# Altium project ZHL_RF_AMP.PrjPcb
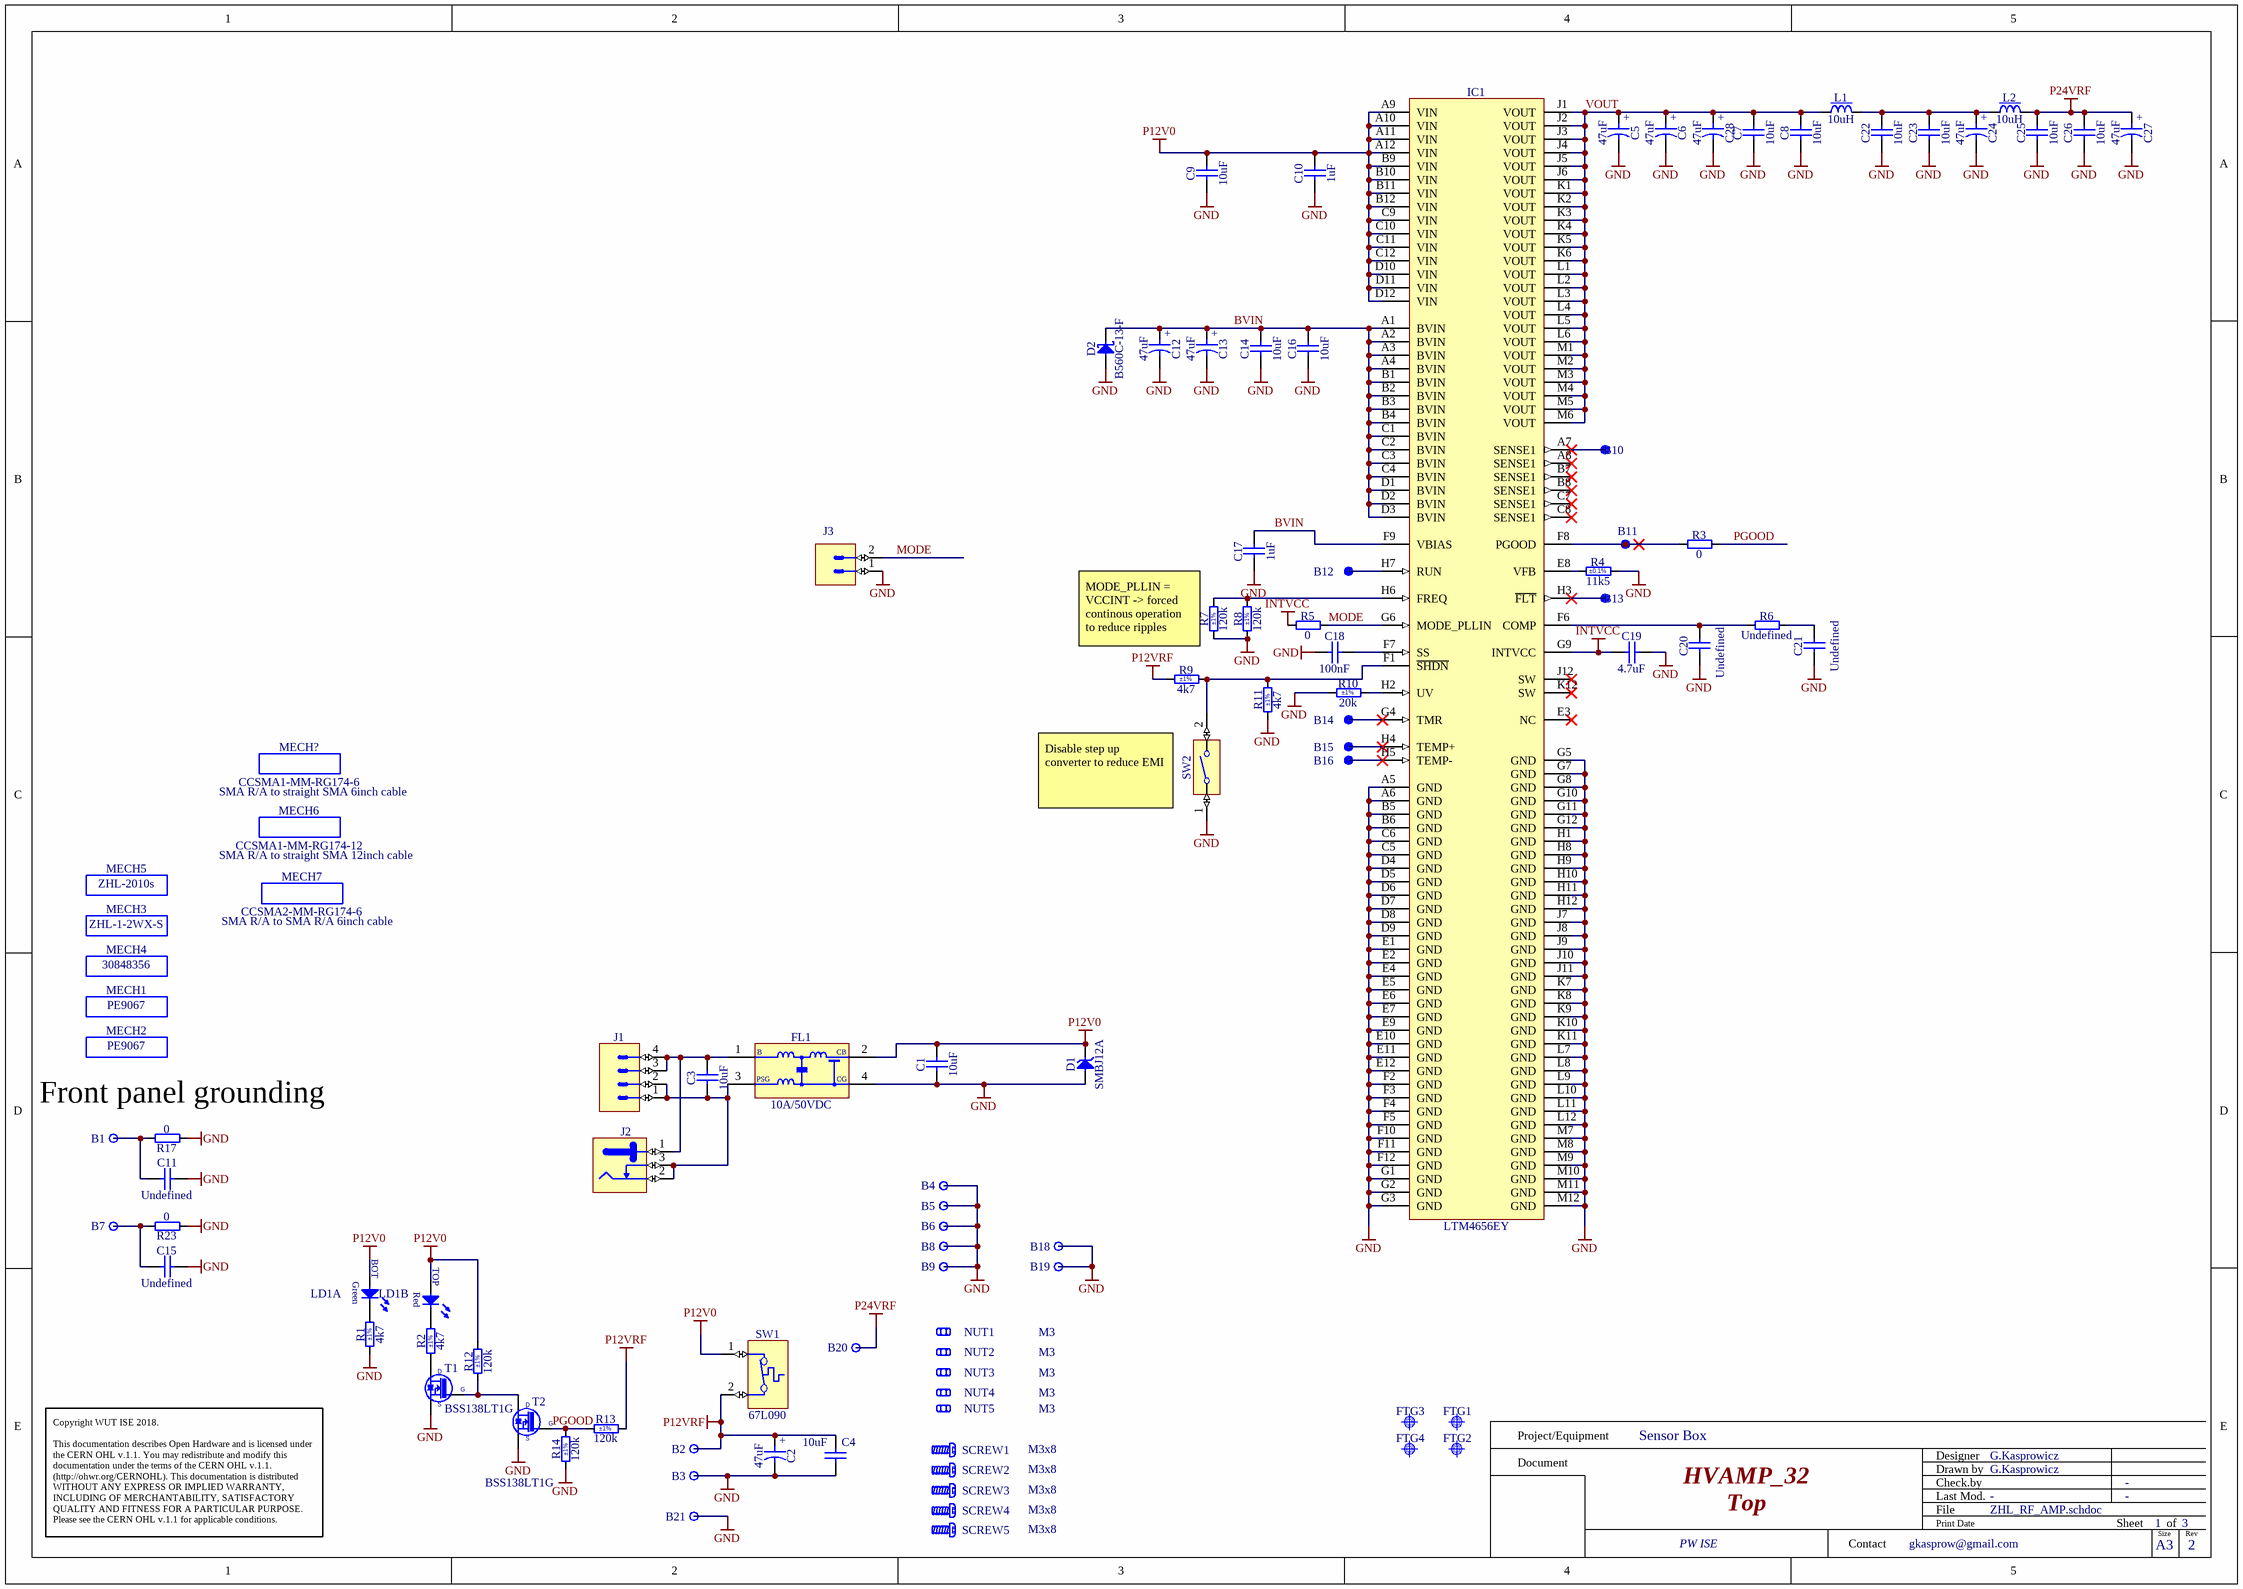
[diagram p0: ZHL_RF_AMP.schdoc]
1 sheet, 100 parts. Net scope: global (net labels, ports and power ports of the same name join across sheets).
Board files: ZHL_RF_AMP.pcbdoc, Panel_ZHL-1-2WX-S_RF_AMP.PcbDoc, Panel_ZHL-2010s_RF_AMP.PcbDoc

## Sheet ZHL_RF_AMP.schdoc: HVAMP_32
size 420 x 297 mm; EDA_Number: ARTIQ; Projet: Fastino; Author: G.Kasprowicz; CompanyName: WUT ISE; DrawnBy: G.Kasprowicz; Organization: WUT ISE; Address1: PW ISE; Address2: Nowowiejska 15/19 00-665 Warsaw; Address3: gkasprow@gmail.com; DocumentNumber: 1; Revision: 2; SheetNumber: 1; SheetTotal: 3; ModifiedBy: -; CheckedDate: -; Title2: Top; DivGrp: WUT ISE; Designer: G.Kasprowicz; ModifiedDate: -; ProjectName: Sensor Box

### Parts
B1  Plated Hole  [MTG270_500]  (value not drawn)
B2  Plated Hole  [c130h80]  (value not drawn)  (no BOM)
B3  Plated Hole  [c130h80]  (value not drawn)  (no BOM)
B4  Plated Hole  [MTG320_700]  (value not drawn)  (no BOM)
B5  Plated Hole  [MTG320_700]  (value not drawn)  (no BOM)
B6  Plated Hole  [MTG320_700]  (value not drawn)  (no BOM)
B7  Plated Hole  [MTG270_500]  (value not drawn)
B8  Plated Hole  [MTG320_700]  (value not drawn)  (no BOM)
B9  Plated Hole  [MTG320_700]  (value not drawn)  (no BOM)
B10  SMD Pad  [C100]  (value not drawn)
B11  SMD Pad  [C100]  (value not drawn)
B12  SMD Pad  [C100]  (value not drawn)
B13  SMD Pad  [C100]  (value not drawn)
B14  SMD Pad  [C100]  (value not drawn)
B15  SMD Pad  [C100]  (value not drawn)
B16  SMD Pad  [C100]  (value not drawn)
B18  Plated Hole  [MTG320_700]  (value not drawn)  (no BOM)
B19  Plated Hole  [MTG320_700]  (value not drawn)  (no BOM)
B20  Plated Hole  [c130h80]  (value not drawn)  (no BOM)
B21  Plated Hole  [c130h80]  (value not drawn)  (no BOM)
C1  10uF  [CAPC3216X190N]
C2  47uF  [CAPMP7343X430N]
C3  10uF  [CAPC3216X190N]
C4  10uF  [CAPC3216X190N]
C5  47uF  [CAPMP7343X430N]
C6  47uF  [CAPMP7343X430N]
C7  10uF  [CAPC3216X190N]
C8  10uF  [CAPC3216X190N]
C9  10uF  [CAPC3216X190N]
C10  1uF  [CAPC1608X87N]
C11  Undefined  [CAPC2012X135N]
C12  47uF  [CAPMP7343X430N]
C13  47uF  [CAPMP7343X430N]
C14  10uF  [CAPC3216X190N]
C15  Undefined  [CAPC2012X135N]
C16  10uF  [CAPC3216X190N]
C17  1uF  [CAPC1608X87N]
C18  100nF  [CAPC1005X55N]
C19  4.7uF  [CAPC1608X90N]
C20  Undefined  [CAPC1608X90N]
C21  Undefined  [CAPC1608X90N]
C22  10uF  [CAPC3216X190N]
C23  10uF  [CAPC3216X190N]
C24  47uF  [CAPMP7343X430N]
C25  10uF  [CAPC3216X190N]
C26  10uF  [CAPC3216X190N]
C27  47uF  [CAPMP7343X430N]
C28  47uF  [CAPMP7343X430N]
D1  SMBJ12A  [DIOM5336X265N]
D2  B560C-13-F  [DIOM7959X250N]
FL1  10A/50VDC  [FIL_MURATA_BNX02]
FTG1  Use only in PCB  [FIDUCIAL_TOP_C100-200]  (value not drawn)
FTG2  Use only in PCB  [FIDUCIAL_TOP_S100-200]  (value not drawn)
FTG3  Use only in PCB  [FIDUCIAL_TOP_C100-200]  (value not drawn)
FTG4  Use only in PCB  [FIDUCIAL_TOP_S100-200]  (value not drawn)
IC1  LTM4656EY  [BGA144C127P12X12_1600X1600X742]
J1  Mini-Fit Jr.™  [MOLEX_39-30-0040]  (value not drawn)
J2  Jack  [SWITCHCRAFT_712RA]  (value not drawn)
J3  Header 2  [SAMTEC_HTSW-101-23-L-D]  (value not drawn)
L1  10uH  [INDM6965X300N]
L2  10uH  [INDM6965X300N]
LD1  Red/Green  [LED_DIALIGHT_571-0112F]  (value not drawn)  (parts A,B of 2)
MECH1  PE9067  [GENERIC_MECH]
MECH2  PE9067  [GENERIC_MECH]
MECH3  ZHL-1-2WX-S  [GENERIC_MECH]
MECH4  30848356  [GENERIC_MECH]
MECH5  ZHL-2010s  [GENERIC_MECH]
MECH6  CCSMA1-MM-RG174-12  Part Description: SMA R/A to straight SMA 12inch cable  [GENERIC_MECH]
MECH7  CCSMA2-MM-RG174-6  Part Description: SMA R/A to SMA R/A 6inch cable  [GENERIC_MECH]
MECH?  CCSMA1-MM-RG174-6  Part Description: SMA R/A to straight SMA 6inch cable  [GENERIC_MECH]
NUT1  M3  [BOSSARD_BN628-1241443_v]
NUT2  M3  [BOSSARD_BN628-1241443_v]
NUT3  M3  [BOSSARD_BN628-1241443_v]
NUT4  M3  [BOSSARD_BN628-1241443_v]
NUT5  M3  [BOSSARD_BN628-1241443_v]
R1  4k7  Tolerance: ±1%  [RESC1608X55N]
R2  4k7  Tolerance: ±1%  [RESC1608X55N]
R3  0  [RESC1608X55N]
R4  11k5  Tolerance: ±0.1%  [RESC1608X55N]
R5  0  [RESC1608X55N]
R6  Undefined  [RESC1608X55N]
R7  120k  Tolerance: ±1%  [RESC1005X40N]
R8  120k  Tolerance: ±1%  [RESC1005X40N]
R9  4k7  Tolerance: ±1%  [RESC1608X55N]
R10  20k  Tolerance: ±1%  [RESC1608X55N]
R11  4k7  Tolerance: ±1%  [RESC1608X55N]
R12  120k  Tolerance: ±1%  [RESC1005X40N]
R13  120k  Tolerance: ±1%  [RESC1005X40N]
R14  120k  Tolerance: ±1%  [RESC1005X40N]
R17  0  [RESC1608X55N]
R23  0  [RESC1608X55N]
SCREW1  M3x8  [BOSSARD_BN5687-3061606_v]
SCREW2  M3x8  [BOSSARD_BN5687-3061606_v]
SCREW3  M3x8  [BOSSARD_BN5687-3061606_v]
SCREW4  M3x8  [BOSSARD_BN5687-3061606_v]
SCREW5  M3x8  [BOSSARD_BN5687-3061606_v]
SW1  67L090  [AIRPAX_6700_h_a]
SW2  Switch  [SW_OMRON_A6SN-1101]  (value not drawn)
T1  BSS138LT1G  [SOT95P240X110-3N]
T2  BSS138LT1G  [SOT95P240X110-3N]

### Nets
GND: B3.1 B4.1 B5.1 B6.1 B8.1 B9.1 B18.1 B19.1 B21.1 C1.1 C2.2 C4.1 C5.2 C6.2 C7.1 C8.1 C9.1 C10.1 C11.2 C12.2 C13.2 C14.1 C15.2 C16.1 C17.1 C18.1 C19.2 C20.1 C21.1 C22.1 C23.1 C24.2 C25.1 C26.1 C27.2 C28.2 D1.2(A) D2.2(A) FL1.4(CG) IC1.A5(GND) IC1.A6(GND) IC1.B5(GND) IC1.B6(GND) IC1.C5(GND) IC1.C6(GND) IC1.D4(GND) IC1.D5(GND) IC1.D6(GND) IC1.D7(GND) IC1.D8(GND) IC1.D9(GND) IC1.E1(GND) IC1.E2(GND) IC1.E4(GND) IC1.E5(GND) IC1.E6(GND) IC1.E7(GND) IC1.E9(GND) IC1.E10(GND) IC1.E11(GND) IC1.E12(GND) IC1.F2(GND) IC1.F3(GND) IC1.F4(GND) IC1.F5(GND) IC1.F10(GND) IC1.F11(GND) IC1.F12(GND) IC1.G1(GND) IC1.G2(GND) IC1.G3(GND) IC1.G5(GND) IC1.G7(GND) IC1.G8(GND) IC1.G10(GND) IC1.G11(GND) IC1.G12(GND) IC1.H1(GND) IC1.H8(GND) IC1.H9(GND) IC1.H10(GND) IC1.H11(GND) IC1.H12(GND) IC1.J7(GND) IC1.J8(GND) IC1.J9(GND) IC1.J10(GND) IC1.J11(GND) IC1.K7(GND) IC1.K8(GND) IC1.K9(GND) IC1.K10(GND) IC1.K11(GND) IC1.L7(GND) IC1.L8(GND) IC1.L9(GND) IC1.L10(GND) IC1.L11(GND) IC1.L12(GND) IC1.M7(GND) IC1.M8(GND) IC1.M9(GND) IC1.M10(GND) IC1.M11(GND) IC1.M12(GND) J3.1 R1.1 R4.2 R7.1 R8.1 R10.1 R11.1 R14.1 R17.1 R23.1 SW2.1 T1.2(S) T2.2(S)
INTVCC: C19.1 IC1.G9(INTVCC) R5.1
P12V0: C1.2 C9.2 C10.2 D1.1(C) FL1.2(CB) IC1.A9(VIN) IC1.A10(VIN) IC1.A11(VIN) IC1.A12(VIN) IC1.B9(VIN) IC1.B10(VIN) IC1.B11(VIN) IC1.B12(VIN) IC1.C9(VIN) IC1.C10(VIN) IC1.C11(VIN) IC1.C12(VIN) IC1.D10(VIN) IC1.D11(VIN) IC1.D12(VIN) LD1.2(A) LD1.4(A) R12.2 SW1.1
P12VRF: B2.1 C2.1 C4.2 R9.1 R13.2 SW1.2
P24VRF: B20.1 C25.2 C26.2 C27.1 L2.2
BVIN: C12.1 C13.1 C14.2 C16.2 C17.2 D2.1(C) IC1.A1(BVIN) IC1.A2(BVIN) IC1.A3(BVIN) IC1.A4(BVIN) IC1.B1(BVIN) IC1.B2(BVIN) IC1.B3(BVIN) IC1.B4(BVIN) IC1.C1(BVIN) IC1.C2(BVIN) IC1.C3(BVIN) IC1.C4(BVIN) IC1.D1(BVIN) IC1.D2(BVIN) IC1.D3(BVIN) IC1.F9(VBIAS)
MODE: IC1.G6(MODE_PLLIN) J3.2 R5.2
PGOOD: R3.2 R13.1 R14.2 T2.1(G)
VOUT: C5.1 C6.1 C7.2 C8.2 C28.1 IC1.J1(VOUT) IC1.J2(VOUT) IC1.J3(VOUT) IC1.J4(VOUT) IC1.J5(VOUT) IC1.J6(VOUT) IC1.K1(VOUT) IC1.K2(VOUT) IC1.K3(VOUT) IC1.K4(VOUT) IC1.K5(VOUT) IC1.K6(VOUT) IC1.L1(VOUT) IC1.L2(VOUT) IC1.L3(VOUT) IC1.L4(VOUT) IC1.L5(VOUT) IC1.L6(VOUT) IC1.M1(VOUT) IC1.M2(VOUT) IC1.M3(VOUT) IC1.M4(VOUT) IC1.M5(VOUT) IC1.M6(VOUT) L1.1
NetB1_1: B1.1 C11.1 R17.2
NetB7_1: B7.1 C15.1 R23.2
NetB10_1: B10.1 IC1.A7(SENSE1)
NetB11_1: B11.1 IC1.F8(PGOOD) R3.1
NetB12_1: B12.1 IC1.H7(RUN)
NetB13_1: B13.1 IC1.H3(~{FLT})
NetB14_1: B14.1 IC1.G4(TMR)
NetB15_1: B15.1 IC1.H4(TEMP+)
NetB16_1: B16.1 IC1.H5(TEMP-)
NetC3_1: C3.1 FL1.3(PSG) J1.1 J1.2 J2.2 J2.3
NetC3_2: C3.2 FL1.1(B) J1.3 J1.4 J2.1
NetC18_2: C18.2 IC1.F7(SS)
NetC20_2: C20.2 IC1.F6(COMP) R6.1
NetC21_2: C21.2 R6.2
NetC22_2: C22.2 C23.2 C24.1 L1.2 L2.1
NetIC1_E8: IC1.E8(VFB) R4.1
NetIC1_F1: IC1.F1(~{SHDN}) R9.2 R11.2 SW2.2
NetIC1_H2: IC1.H2(UV) R10.2
NetIC1_H6: IC1.H6(FREQ) R7.2 R8.2
NetLD1_1: LD1.1(C) R1.2
NetLD1_3: LD1.3(C) R2.2
NetR2_1: R2.1 T1.3(D)
NetR12_1: R12.1 T1.1(G) T2.3(D)

Not connected (* = marked no-connect by the designer): IC1 A8(SENSE1)* B7(SENSE1)* B8(SENSE1)* C7(SENSE1)* C8(SENSE1)* E3(NC)* J12(SW)* K12(SW)*

### Notes on the sheet
- (near R7) MODE_PLLIN = VCCINT -> forced continous operation to reduce ripples
- Disable step up converter to reduce EMI
- Front panel grounding
- Project/Equipment
- Document
- Designer
- Drawn by
- Check.by
- Copyright WUT ISE 2018.
  This documentation describes Open Hardware and is licensed under the CERN OHL v.1.1. You may redistribute and modify this documentation under the terms of the CERN OHL v.1.1. (http://ohwr.org/CERNOHL). This documentation is distributed WITHOUT ANY EXPRESS OR IMPLIED WARRANTY, INCLUDING OF MERCHANTABILITY, SATISFACTORY QUALITY AND FITNESS FOR A PARTICULAR PURPOSE. Please see the CERN OHL v.1.1 for applicable conditions.
- Contact
- File
- Last Mod.
- Print Date
- Sheet
- Size
- A3
- of
- Rev
- (in symbol CTE7343-43_47UF_35V_10%_LESR0300) +
- (in symbol LED_DIALIGHT_571-0112F, part A) BOT; Green
- (in symbol LED_DIALIGHT_571-0112F, part B) TOP; Red

### Library data of the parts
B1 B7 = PLATED_HOLE2.7_PAD5.0: Single Terminal Socket; Part Description: Plated Through Hole: Hole Dia.=2.7mm Pad Dia.=5.0mm; Mounted: No; Part Number: PLATED_HOLE2.7_PAD5.0; Component Kind: Standard (No BOM); Component Type: Standard (No BOM); Pin Count: 1; Family: Plated Hole; Socket: No; SMD: No; Sense: No; Status: None; ComponentHeight: 0mm; HelpURL: Undefined; Author: CERN DEM JMW; CreateDate: 27.09.2011; LatestRevisionDate: 27.09.2011; PackageDescription: Plated Through Hole: Hole Dia.=2.7mm Pad Dia.=5.0mm
B2 B3 B20 B21 = PLATED_HOLE0.8_PAD1.3: Single Terminal Socket; Part Description: Plated Through Hole: Hole Dia.=0.8mm Pad Dia.=1.3mm, IPC-7251 Level C; Mounted: No; Part Number: PLATED_HOLE0.8_PAD1.3; Component Type: Standard (No BOM); Pin Count: 1; Family: Plated Hole; Socket: No; SMD: No; Sense: No; Status: None; ComponentHeight: 0mm; HelpURL: Undefined; Author: CERN DEM JLC; CreateDate: 30.10.2008; LatestRevisionDate: 30.10.2008; PackageDescription: Plated Through Hole: Hole Dia.=0.8mm Pad Dia.=1.3mm, IPC-7251 Level C
B4-B6 B8 B9 B18 B19 = PLATED_HOLE3.2_PAD7.0: Single Terminal Socket; Part Description: Plated Through Hole: Hole Dia.=3.2mm Pad Dia.=7.0mm; Mounted: No; Part Number: PLATED_HOLE3.2_PAD7.0; Component Type: Standard (No BOM); Pin Count: 1; Family: Plated Hole; Socket: No; SMD: No; Sense: No; Status: None; ComponentHeight: 0mm; HelpURL: Undefined; Author: CERN DEM JMW; CreateDate: 28.11.2017; LatestRevisionDate: 28.11.2017; PackageDescription: Plated Through Hole: Hole Dia.=3.2mm Pad Dia.=7.0mm
B10-B16 = SMD_PAD_D1MM: Through Hole Pad; Part Description: 1mm Diameter SMD Pad; Mounted: No; Part Number: SMD_PAD_D1MM; Component Kind: Standard (No BOM); Component Type: Standard (No BOM); Pin Count: 1; Family: SMD Pad; Socket: No; SMD: No; Sense: No; Status: None; ComponentHeight: 0mm; HelpURL: Undefined; Author: CERN DEM JLC; CreateDate: 10.10.2017; LatestRevisionDate: 10.10.2017; PackageDescription: 1mm Diameter SMD Pad
C1 C3 C4 C7-C9 C14 C16 C22 C23 C25 C26 = CC1206_10UF_35V_10%_X7R_YUDEN_GMJ316BB7106KLHT: Non-polarised capacitor; Part Description: Soft Termination SMD Multilayer Chip Ceramic Capacitor for Automotive / Industrial Applications; Manufacturer: TAIYO YUDEN; Voltage: 35V; TC: X7R; Tolerance: ±10%; Part Number: CC1206_10UF_35V_10%_X7R_YUDEN_GMJ316BB7106KLHT; Component Kind: Standard; Component Type: Standard; Pin Count: 2; Value: 10uF; Status: Not Recommended; Manufacturer Part Number: GMJ316BB7106KLHT; Case: 1206; Mounted: Yes; Socket: No; SMD: Yes; Sense: No; HelpURL: \\cern.ch\dfs\Applications\Altium\Datasheets\CC1206_TAIYO-YUDEN_GMJ316BB7106KLHT.pdf; Author: CERN DEM BC; CreateDate: 26.02.2016; LatestRevisionDate: 17.12.2018; ComponentHeight: 1.90mm
C2 C5 C6 C12 C13 C24 C27 C28 = CTE7343-43_47UF_35V_10%_LESR0300: Polarised capacitor; Part Description: ESR 0R3 Solid Tantalum Chip Capacitor; Manufacturer: GENERIC; Manufacturer1 Part Number: T495X476K035ATE300; Voltage: 35V; Tolerance: ±10%; Part Number: CTE7343-43_47UF_35V_10%_LESR0300; Component Kind: Standard; Component Type: Standard; Pin Count: 2; Value: 47uF; Status: Preferred; Manufacturer Part Number: CTE7343-43_47UF_35V_10%_LESR0300; Case: E; Mounted: Yes; Socket: No; SMD: Yes; Sense: No; Manufacturer1 Example: KEMET; Manufacturer1 ComponentHeight: 4.3mm; HelpURL: \\cern.ch\dfs\Applications\Altium\Datasheets\CTE_KEMET_T495.pdf; Author: CERN DEM JLC; CreateDate: 27.05.2013; LatestRevisionDate: 29.10.2018
C10 C17 = CC0603_1UF_25V_10%_X7R: Non-polarised capacitor; Part Description: SMD Multilayer Chip Ceramic Capacitor; Manufacturer: GENERIC; Manufacturer1 Part Number: GRM188R71E105KA12D; Voltage: 25V; TC: X7R; Tolerance: ±10%; Part Number: CC0603_1UF_25V_10%_X7R; Component Kind: Standard; Component Type: Standard; Pin Count: 2; Value: 1uF; Status: None; Manufacturer Part Number: CC0603_1UF_25V_10%_X7R; Case: 0603; Mounted: Yes; Socket: No; SMD: Yes; Sense: No; Manufacturer1 Example: MURATA; Manufacturer1 ComponentHeight: 0.9mm; HelpURL: \\cern.ch\dfs\Applications\Altium\Datasheets\CC0603_X7R_MURATA.pdf; Author: CERN DEM JLC; CreateDate: 18.01.2011; LatestRevisionDate: 18.01.2011
C11 C15 = CC0805_NO-VALUE: Non-polarised capacitor; Part Description: Reserved Footprint For 0805(2012) Chip Ceramic Capacitor; Mounted: No; Part Number: CC0805_NO-VALUE; Component Kind: Standard; Component Type: Standard; Pin Count: 2; Value: Undefined; Status: None; Manufacturer: Undefined; Manufacturer Part Number: CC0805_NO-VALUE; Case: 0805; Socket: No; SMD: Yes; Sense: No; Manufacturer1 ComponentHeight: 1.35mm; HelpURL: Undefined; Author: CERN DEM JLC; CreateDate: 10.12.2008; LatestRevisionDate: 11.09.2013
C18 = CC0402_100NF_50V_10%_X7R: Non-polarised capacitor; Part Description: SMD Multilayer Chip Ceramic Capacitor; Manufacturer: GENERIC; Manufacturer1 Part Number: GRM155R71H104KE14D; Voltage: 50V; TC: X7R; Tolerance: ±10%; Part Number: CC0402_100NF_50V_10%_X7R; Component Kind: Standard; Component Type: Standard; Pin Count: 2; Value: 100nF; Status: None; Manufacturer Part Number: CC0402_100NF_50V_10%_X7R; Case: 0402; Mounted: Yes; Socket: No; SMD: Yes; Sense: No; Manufacturer1 Example: MURATA; Manufacturer1 ComponentHeight: 0.55mm; HelpURL: \\cern.ch\dfs\Applications\Altium\Datasheets\CC0402_MURATA_GRM155R71H104KE14D.pdf; Author: CERN DEM MR; CreateDate: 30.06.2017; LatestRevisionDate: 30.06.2017
C19 = CC0603_4.7UF_25V_10%_X5R: Non-polarised capacitor; Part Description: SMD Multilayer Chip Ceramic Capacitor; Manufacturer: GENERIC; Manufacturer1 Part Number: GRM188R61E475KE11D; Voltage: 25V; TC: X5R; Tolerance: ±10%; Part Number: CC0603_4.7UF_25V_10%_X5R; Component Kind: Standard; Component Type: Standard; Pin Count: 2; Value: 4.7uF; Status: None; Manufacturer Part Number: CC0603_4.7UF_25V_10%_X5R; Case: 0603; Mounted: Yes; Socket: No; SMD: Yes; Sense: No; Manufacturer1 Example: MURATA; Manufacturer1 ComponentHeight: 0.95mm; HelpURL: \\cern.ch\dfs\Applications\Altium\Datasheets\CC0603_MURATA_GRM188R61E475KE11D.pdf; Author: CERN DEM JLC; CreateDate: 10.11.2014; LatestRevisionDate: 10.11.2014
C20 C21 = CC0603_NO-VALUE: Non-polarised capacitor; Part Description: Reserved Footprint For 0603(1608) Chip Ceramic Capacitor; Mounted: No; Part Number: CC0603_NO-VALUE; Component Kind: Standard; Component Type: Standard; Pin Count: 2; Value: Undefined; Status: None; Manufacturer: Undefined; Manufacturer Part Number: CC0603_NO-VALUE; Case: 0603; Socket: No; SMD: Yes; Sense: No; Manufacturer1 ComponentHeight: 0.9mm; HelpURL: Undefined; Author: CERN DEM MR; CreateDate: 22.11.2016; LatestRevisionDate: 22.11.2016
D1 = SMBJ12A: Zener Diode; Part Description: Uni-Directional Transient Voltage Suppressor Diode; Manufacturer: FAIRCHILD SEMICONDUCTOR; Voltage: 12V; Power: 600W; PressFit: No; Bonding: No; Part Number: SMBJ12A; Component Kind: Standard; Component Type: Standard; Device: SMBJ12A; PackageDescription: DO-214-AA/SMB Diode, Molded Body; 5.34mm L X 3.625mm W X 2.65mm H, IPC Medium Density; Manufacturer Part Number: SMBJ12A; Pin Count: 2; Case: DO-214AA; Mounted: Yes; Socket: No; SMD: Yes; Sense: No; ComponentHeight: 2.65mm; HelpURL: \\cern.ch\dfs\Applications\Altium\Datasheets\SMBJ.pdf; Author: CERN DEM JLC; CreateDate: 10.04.2013; LatestRevisionDate: 10.04.2013
D2 = B560C-13-F: Schottky Diode; Part Description: Surface Mount Schottky Barrier Rectifier; Manufacturer: DIODES INCORPORATED; Manufacturer Part Number: B560C; Voltage: 60V; Power: 5A; PressFit: No; Bonding: No; Part Number: B560C-13-F; Component Kind: Standard; Component Type: Standard; Device: B560C-13-F; PackageDescription: DO-214-AB/SMC Molded Diode, Body 7.9x5.9mm, IPC Medium Density; Pin Count: 2; Case: SMC; Mounted: Yes; Socket: No; SMD: Yes; Sense: No; ComponentHeight: 2.5mm; HelpURL: \\cern.ch\dfs\Applications\Altium\Datasheets\B560C-13-F.pdf; Author: CERN DEM MR; CreateDate: 14.03.2016; LatestRevisionDate: 29.06.2022
FL1 = FIL_MURATA_BNX022-01L: Block Type EMIFIL (LC Combined); Part Description: Block Type EMIFIL (LC Combined) SMD Type, BNX02* Series; Manufacturer: MURATA; Resistance: 0.5R; Part Number: FIL_MURATA_BNX022-01L; Component Kind: Standard; Component Type: Standard; Pin Count: 2; Value: 10A/50VDC; Status: None; Manufacturer Part Number: BNX022-01L; Mounted: Yes; Socket: No; SMD: Yes; Sense: No; ComponentHeight: 3.3mm; HelpURL: \\cern.ch\dfs\Applications\Altium\Datasheets\FIL_MURATA_BNX022-01L.pdf; Author: CERN DEM JLC; CreateDate: 10.10.2012; LatestRevisionDate: 10.10.2012
FTG1 FTG3 = FIDUCIAL_TARGET_C100-200: Fiducial Target; Part Description: Round Fiducial Target, Top Layer, 1.0mm, Top Solder 2.0mm, Keepout =2.0mm; Mounted: No; Part Number: FIDUCIAL_TARGET_C100-200; Component Kind: Standard (No BOM); Component Type: Standard (No BOM); Pin Count: 1; Family: Fiducial; Socket: No; SMD: Yes; Sense: No; Status: None; ComponentHeight: 0mm; HelpURL: Undefined; Author: CERN DEM JLC; CreateDate: 09.02.2010; LatestRevisionDate: 04.04.2012; PackageDescription: Round Fiducial Target, Top Layer, 1.0mm, Top Solder 2.0mm, Keepout =2.0mm
FTG2 FTG4 = FIDUCIAL_TARGET_S100-200: Fiducial Target; Part Description: Square Fiducial Target, Top Layer, 1.0mm, Top Solder 2.0mm, Keepout =2.0mm; Mounted: No; Part Number: FIDUCIAL_TARGET_S100-200; Component Kind: Standard (No BOM); Component Type: Standard (No BOM); Pin Count: 1; Family: Fiducial; Socket: No; SMD: Yes; Sense: No; Status: None; ComponentHeight: 0mm; HelpURL: Undefined; Author: CERN DEM JLC; CreateDate: 09.02.2010; LatestRevisionDate: 04.04.2012; PackageDescription: Square Fiducial Target, Top Layer, 1.0mm, Top Solder 2.0mm, Keepout =2.0mm
IC1 = LTM4656EY: 60V, 5A Silent Switcher uModule Regulator; Part Description: 4.5V-28V to 6V-36V 180W Synchronous Boost µModule Regulator with Input-Output Short Protection; Manufacturer: ANALOG DEVICES; PressFit: No; Bonding: No; Part Number: LTM4656EY; Component Kind: Standard; Component Type: Standard; Device: LTM4656EY; PackageDescription: BGA, 1.27mm Pitch, Rect.; 144 Pin, 12 Columns X 12 Rows, 16.0mm X 16.0mm X 7.42mm H body, IPC Medium Density; Manufacturer Part Number: LTM4656EY; Pin Count: 144; Case: BGA144; Mounted: Yes; Socket: No; SMD: Yes; Sense: No; ComponentHeight: 7.42mm; HelpURL: \\cern.ch\dfs\Applications\Altium\Datasheets\LTM4656.pdf; Author: CERN DEM HF; CreateDate: 05.09.2022; LatestRevisionDate: 05.09.2022
J1 = MOLEX_39-30-0040: Connector 4 Male; Part Description: 4.20mm (.165") Pitch Mini-Fit Jr. Header, Dual Row, Right Angle with Snap-in Plastic Peg PCB Lock, 4 Circuits; Manufacturer: MOLEX; PressFit: No; Part Number: MOLEX_39-30-0040; Component Kind: Standard; Component Type: Standard; Pin Count: 4; Family: Mini-Fit Jr.™; Mounted: Yes; Socket: No; SMD: No; Sense: No; Status: None; Manufacturer Part Number: 39-30-0040; ComponentHeight: 11.4mm; HelpURL: \\cern.ch\dfs\Applications\Altium\Datasheets\MOLEX_39-30-0040.pdf; Author: CERN DEM JLC; CreateDate: 2018-10-02; LatestRevisionDate: 2018-10-02
J2 = SWITCHCRAFT_712RA: 2.5 mm Center Pin, 5A, 48V, Right Angle, Through Hole, , DC Power Jack Connector; Part Description: 2.5 mm Center Pin, 5A, 48VDC, Right Angle, Through Hole, Locking Power Jack Connector (Threaded Bushings); Manufacturer Part Number: 712RA; PressFit: No; Part Number: SWITCHCRAFT_712RA; Component Kind: Standard; Component Type: Standard; Pin Count: 3; Family: Jack; Mounted: Yes; Socket: No; SMD: No; Sense: No; Status: None; Manufacturer: SWITCHCRAFT; ComponentHeight: 13.8mm; HelpURL: \\cern.ch\dfs\Applications\Altium\Datasheets\SWITCHCRAFT_712RA.pdf; Author: CERN DEM JLC; CreateDate: 2017-12-19; LatestRevisionDate: 2017-12-19
J3 = SAMTEC_HTSW-101-23-L-D: Connector 2 Male; Part Description: 2 Contacts, Pitch 2.54mm, Dual Row Through Mount Straight Header (Post Lead 5.84mm, Tail Lead 2.92mm, Insulator 2.54mm); Manufacturer: SAMTEC; PressFit: No; Status Comment: High Temperature; Part Number: SAMTEC_HTSW-101-23-L-D; Component Kind: Standard; Component Type: Standard; Pin Count: 2; Family: Header 2; Mounted: Yes; Socket: No; SMD: No; Sense: No; Status: Preferred; Manufacturer Part Number: HTSW-101-23-L-D; ComponentHeight: 8.38mm; HelpURL: \\cern.ch\dfs\Applications\Altium\Datasheets\SAMTEC_HTSW-101-23-L-D.pdf; Author: CERN DEM JLC; CreateDate: 22.02.2018; LatestRevisionDate: 22.02.2018
L1 L2 = IND2525_10UH_20%_VISHAY_IHLP-2525CZ: Inductor With Core; Part Description: Low Profile, High Current IHLP® Inductor; Manufacturer: VISHAY DALE; Manufacturer Part Number: IHLP2525CZER100M01; Power: 3A; Resistance: 0.102R; Tolerance: ±20%; Part Number: IND2525_10UH_20%_VISHAY_IHLP-2525CZ; Component Kind: Standard; Component Type: Standard; Pin Count: 2; Value: 10uH; Case: 2525; Mounted: Yes; Socket: No; SMD: Yes; Sense: No; ComponentHeight: 3mm; HelpURL: \\cern.ch\dfs\Applications\Altium\Datasheets\IND2525_VISHAY_IHLP-2525CZ.pdf; Author: CERN DEM JLC; CreateDate: 19.01.2015; LatestRevisionDate: 19.01.2015
LD1 = LED_DIALIGHT_571-0112F: 2x LED  Botom Green, Top Red; Part Description: Dual 2mm  LEDs, Red Top,Green Bot, CBI® Circuit Board Indicator (Without positioning pins); PressFit: No; Bonding: No; Part Number: LED_DIALIGHT_571-0112F; Component Kind: Standard; Component Type: Standard; Color: Red/Green; PackageDescription: 2x 2mm LED (Top: Red, Bot: Green) PCB Edge Mounting (Without positioning pins) DIALIGHT 571 Serie; Manufacturer: DIALIGHT; Manufacturer Part Number: 571-0112F; Pin Count: 4; Mounted: Yes; Socket: No; SMD: No; Sense: No; ComponentHeight: 8.6mm; HelpURL: \\cern.ch\dfs\Applications\Altium\Datasheets\LED_DIALIGHT_571-0112F.pdf; Author: CERN DEM JLC; CreateDate: 09.11.2009; LatestRevisionDate: 17.03.2010
MECH1 MECH2 = Generic_mechanical: generic; Part Description: Isolated Ground SMA Female to SMA Female Bulkhead Mount Adapter, with Plastic Isolator; Manufacturer: Pasternack; PressFit: No; Part Number: PE9067; Component Kind: Accessories; Component Type: Standard; Footprint: generic_MECH; Pin Count: 0; PackageDescription: generic; Mounted: Yes; Socket: No; SMD: No; Sense: No; Status: None; Value: PE9067; Manufacturer Part Number: PE9067; ComponentHeight: generic; Author: GK; CreateDate: 28.10.2019; LatestRevisionDate: 28.10.2019
MECH3 MECH5 = Generic_mechanical: generic; Part Description: MC amplifier; Manufacturer: Mini Circuits; PressFit: No; Component Kind: Accessories; Component Type: Standard; Footprint: generic_MECH; Pin Count: 0; PackageDescription: generic; Mounted: Yes; Socket: No; SMD: No; Sense: No; Status: None; ComponentHeight: generic; Author: GK; CreateDate: 28.10.2019; LatestRevisionDate: 28.10.2019
  MECH3: Part Number: ZHL-1-2WX-S; Value: ZHL-1-2WX-S; Manufacturer Part Number: ZHL-1-2WX-S
  MECH5: Part Number: ZHL-2010s; Value: ZHL-2010s; Manufacturer Part Number: ZHL-2010s
MECH4 = Generic_mechanical: generic; Part Description: 8HP front panel; Manufacturer: nVent; PressFit: No; Part Number: 30848356; Component Kind: Accessories; Component Type: Standard; Footprint: generic_MECH; Pin Count: 0; PackageDescription: generic; Mounted: Yes; Socket: No; SMD: No; Sense: No; Status: None; Value: 30848356; Manufacturer Part Number: 30848356; ComponentHeight: generic; Author: GK; CreateDate: 28.10.2019; LatestRevisionDate: 28.10.2019
MECH6 MECH7 MECH? = Generic_mechanical: generic; Manufacturer: Crystek Corporation; PressFit: No; Component Kind: Accessories; Component Type: Standard; Footprint: generic_MECH; Pin Count: 0; PackageDescription: generic; Mounted: Yes; Socket: No; SMD: No; Sense: No; Status: None; ComponentHeight: generic; Author: GK; CreateDate: 28.10.2019; LatestRevisionDate: 28.10.2019
  MECH6: Part Number: CCSMA1-MM-RG174-12; Value: CCSMA1-MM-RG174-12; Manufacturer Part Number: CCSMA1-MM-RG174-12
  MECH7: Part Number: CCSMA2-MM-RG174-6; Value: CCSMA2-MM-RG174-6; Manufacturer Part Number: CCSMA2-MM-RG174-6
  MECH?: Part Number: CCSMA1-MM-RG174-6; Value: CCSMA1-MM-RG174-6; Manufacturer Part Number: CCSMA1-MM-RG174-6
NUT1-NUT5 = BOSSARD_BN628-1241443_v: Nut; Part Description: M3 Hexagon Nut ~0,8d, ISO 4032, DIN 934, Stainless Steel A2; Manufacturer Part Number: BN628 Art.1241443; PressFit: No; Part Number: BOSSARD_BN628-1241443_v; Component Kind: Standard; Component Type: Mechanical; Pin Count: 0; PackageDescription: M3 Hexagon Nut ~0,8d, ISO 4032, DIN 934, Stainless Steel A2; Mounted: Yes; Socket: No; SMD: No; Sense: No; Status: None; Value: M3; Manufacturer: BOSSARD; ComponentHeight: 2.4mm; HelpURL: \\cern.ch\dfs\Applications\Altium\Datasheets\BOSSARD_BN628-1241443.pdf; Author: CERN DEM JMW; CreateDate: 04.12.2015; LatestRevisionDate: 04.12.2015
R1 R2 R9 R11 = R0603_4K7_1%_0.1W_100PPM: Resistor - 1%; Part Description: General Purpose Thick Film Chip Resistor; Manufacturer: GENERIC; Manufacturer1 Part Number: NRC06F4701TRF; Power: 0.1W; TC: ±100ppm/°C; PressFit: No; Part Number: R0603_4K7_1%_0.1W_100PPM; Component Kind: Standard; Component Type: Standard; Pin Count: 2; Value: 4k7; Status: Preferred; Manufacturer Part Number: R0603_4K7_1%_0.1W_100PPM; Case: 0603; Mounted: Yes; Sense: No; Socket: No; SMD: Yes; Manufacturer1 Example: NIC COMPONENT; Manufacturer1 ComponentHeight: 0.55mm; HelpURL: \\cern.ch\dfs\Applications\Altium\Datasheets\R0603_NIC_NRC.pdf; Author: CERN DEM JLC; CreateDate: 03.12.2007; LatestRevisionDate: 13.03.2008
R3 R5 R17 R23 = R0603_0R_JUMPER: Resistor; Part Description: 1A (0.05R Max DC Resistance) Zero Ohm Jumper; Manufacturer: GENERIC; Manufacturer1 Part Number: NRC06Z0; PressFit: No; Part Number: R0603_0R_JUMPER; Component Kind: Standard; Component Type: Standard; Pin Count: 2; Value: 0; Status: Preferred; Manufacturer Part Number: R0603_0R_JUMPER; Case: 0603; Mounted: Yes; Sense: No; Socket: No; SMD: Yes; Manufacturer1 Example: NIC COMPONENT; Manufacturer1 ComponentHeight: 0.55mm; HelpURL: \\cern.ch\dfs\Applications\Altium\Datasheets\R0603_NIC_NRC.pdf; Author: CERN DEM JLC; CreateDate: 03.12.2007; LatestRevisionDate: 13.03.2008
R4 = R0603_11K5_0.1%_0.063W_10PPM: Resistor - 0.1%; Part Description: Thin Film Chip Resistor; Manufacturer: GENERIC; Manufacturer1 Part Number: RN73C1J11K5BTDF; Power: 0.063W; TC: ±10ppm; PressFit: No; Part Number: R0603_11K5_0.1%_0.063W_10PPM; Component Kind: Standard; Component Type: Standard; Pin Count: 2; Value: 11k5; Status: Not Recommended; Manufacturer Part Number: R0603_11K5_0.1%_0.063W_10PPM; Case: 0603; Mounted: Yes; Sense: No; Socket: No; SMD: Yes; Manufacturer1 Example: TYCO HOLSWORTHY; Manufacturer1 ComponentHeight: 0.5mm; HelpURL: \\cern.ch\dfs\Applications\Altium\Datasheets\R0603_Tyco_RN73.pdf; Author: CERN DEM JLC; CreateDate: 03.12.2007; LatestRevisionDate: 13.03.2008
R6 = R0603_NO-VALUE: Resistor; Part Description: Reserved Footprint For a 0603 (1608) Chip Resistor; PressFit: No; Mounted: No; Part Number: R0603_NO-VALUE; Component Kind: Standard; Component Type: Standard; Pin Count: 2; Value: Undefined; Status: None; Manufacturer: Undefined; Manufacturer Part Number: R0603_NO-VALUE; Case: 0603; Sense: No; Socket: No; SMD: Yes; Manufacturer1 Example: Undefined; Manufacturer1 Part Number: Undefined; Manufacturer1 ComponentHeight: Undefined; HelpURL: Undefined; Author: CERN DEM JLC; CreateDate: 03.12.2007; LatestRevisionDate: 13.03.2008
R7 R8 R12-R14 = R0402_120K_1%_0.0625W_100PPM: Resistor - 1%; Part Description: General Purpose Thick Film Chip Resistor; Manufacturer: GENERIC; Manufacturer1 Part Number: 232270671204L; TC: ±100ppm/°C; PressFit: No; Part Number: R0402_120K_1%_0.0625W_100PPM; Component Kind: Standard; Component Type: Standard; Pin Count: 2; Value: 120k; Status: Not Recommended; Power: 0.0625W; Manufacturer Part Number: R0402_120K_1%_0.0625W_100PPM; Case: 0402; Mounted: Yes; Sense: No; Socket: No; SMD: Yes; Manufacturer1 Example: YAGEO PHYCOMP; Manufacturer1 ComponentHeight: 0.4mm; HelpURL: \\cern.ch\dfs\Applications\Altium\Datasheets\R0402_Phycomp_RC0402.pdf; Author: CERN DEM JLC; CreateDate: 03.12.2007; LatestRevisionDate: 17.10.2012
R10 = R0603_20K_1%_0.1W_100PPM: Resistor - 1%; Part Description: General Purpose Thick Film Chip Resistor; Manufacturer: GENERIC; Manufacturer1 Part Number: NRC06F2002TRF; Power: 0.1W; TC: ±100ppm/°C; PressFit: No; Part Number: R0603_20K_1%_0.1W_100PPM; Component Kind: Standard; Component Type: Standard; Pin Count: 2; Value: 20k; Status: Preferred; Manufacturer Part Number: R0603_20K_1%_0.1W_100PPM; Case: 0603; Mounted: Yes; Sense: No; Socket: No; SMD: Yes; Manufacturer1 Example: NIC COMPONENT; Manufacturer1 ComponentHeight: 0.55mm; HelpURL: \\cern.ch\dfs\Applications\Altium\Datasheets\R0603_NIC_NRC.pdf; Author: CERN DEM JLC; CreateDate: 03.12.2007; LatestRevisionDate: 13.03.2008
SCREW1-SCREW5 = BOSSARD_BN5687-3061606_v: Screw; Part Description: M3 L=8mm Hexalobular Socket Pan Head Screw, Fully Threaded, Stainless Steel A2; Manufacturer Part Number: BN5687 Art.3061606; PressFit: No; Part Number: BOSSARD_BN5687-3061606_v; Component Kind: Standard; Component Type: Mechanical; Pin Count: 0; PackageDescription: M3 L=8mm Hexalobular Socket Pan Head Screw, Fully Threaded - Stainless Steel A2; Mounted: Yes; Socket: No; SMD: No; Sense: No; Status: None; Value: M3x8; Manufacturer: BOSSARD; ComponentHeight: 2.4mm; HelpURL: \\cern.ch\dfs\Applications\Altium\Datasheets\BOSSARD_BN5687-3061606.pdf; Author: CERN DEM JLC; CreateDate: 07.02.2013; LatestRevisionDate: 07.02.2013
SW1 = 67L090_h_a: Thermostat SPST (Normaly Close Contact); Part Description: 90°C ±5°C, 0.5A 48VDC, SPST Open on Rise (Normaly Close) Subminiature Bimetal Thermostat; Manufacturer: AIRPAX SENSATA; PressFit: No; Bonding: No; Part Number: 67L090_h_a; Component Kind: Standard; Component Type: Standard; Device: 67L090; PackageDescription: TO-220 2-Terminal - Horizontal Surface Mount Through The Circuit Board; Manufacturer Part Number: 67L090; Pin Count: 2; Case: TO-220; Mounted: Yes; Socket: No; SMD: No; Sense: No; ComponentHeight: 4.95mm; HelpURL: \\cern.ch\dfs\Applications\Altium\Datasheets\67L090.pdf; Author: CERN DEM JLC; CreateDate: 18.06.2013; LatestRevisionDate: 18.06.2013
SW2 = SW_OMRON_A6SN-1101: 1 Ways SPST DIP Switch; Part Description: 1 Way SPST Surface-Mounting Slide Switch with Flat Actuator, Contact Rating 25mA 24VDC; Manufacturer: OMRON; PressFit: No; Part Number: SW_OMRON_A6SN-1101; Component Kind: Standard; Component Type: Standard; Pin Count: 2; PackageDescription: Body 4.48x7.5mm, 1 Way SPST Surface-Mounting Slide Switch With Flat Actuator (A6SN Series); Family: Switch; Mounted: Yes; Socket: No; SMD: Yes; Sense: No; Status: None; Manufacturer Part Number: A6SN-1101; ComponentHeight: 4.6mm; HelpURL: \\cern.ch\dfs\Applications\Altium\Datasheets\SW_OMRON_A6SN-1101.pdf; Author: CERN DEM JLC; CreateDate: 25.02.2013; LatestRevisionDate: 25.02.2013
T1 T2 = BSS138LT1G: N-CHANNEL MOSFET WITH DIODE; Part Description: 50V, 200mA N-Channel Enhancement Mode Field-Effect Transistor; Manufacturer: ON SEMICONDUCTOR; PressFit: No; Bonding: No; Part Number: BSS138LT1G; Component Kind: Standard; Component Type: Standard; Device: BSS138LT1G; PackageDescription: SOT23, 0.95mm Pitch; 3 Pin, 1.40mm W X 3.00mm L X 1.10mm H body, IPC Medium Density; Manufacturer Part Number: BSS138L; Pin Count: 3; Case: SOT23-3; Mounted: Yes; Socket: No; SMD: Yes; Sense: No; ComponentHeight: 1.11mm; HelpURL: \\cern.ch\dfs\Applications\Altium\Datasheets\BSS138LT1G.pdf; Author: CERN DEM JLC; CreateDate: 23.03.2009; LatestRevisionDate: 25.05.2022

## Assembly variants
ZHL-1-2WX-S: not fitted C2 C4 MECH5 MECH?
ZHL2010: not fitted C5 C6 C7 C8 C12 C13 C14 C16 C17 C18 C19 C20 C21 C22 C23 C24 C25 C26 C27 C28 D2 IC1 J3 L1 L2 MECH3 MECH6 R3 R4 R5 R6 R7 R8 R9 R10 R11 SW2